# Altium schematic sheet Dout32x.SchDoc: Dout32x
size A3; Author: Daniel Tzschentke; Revision: A
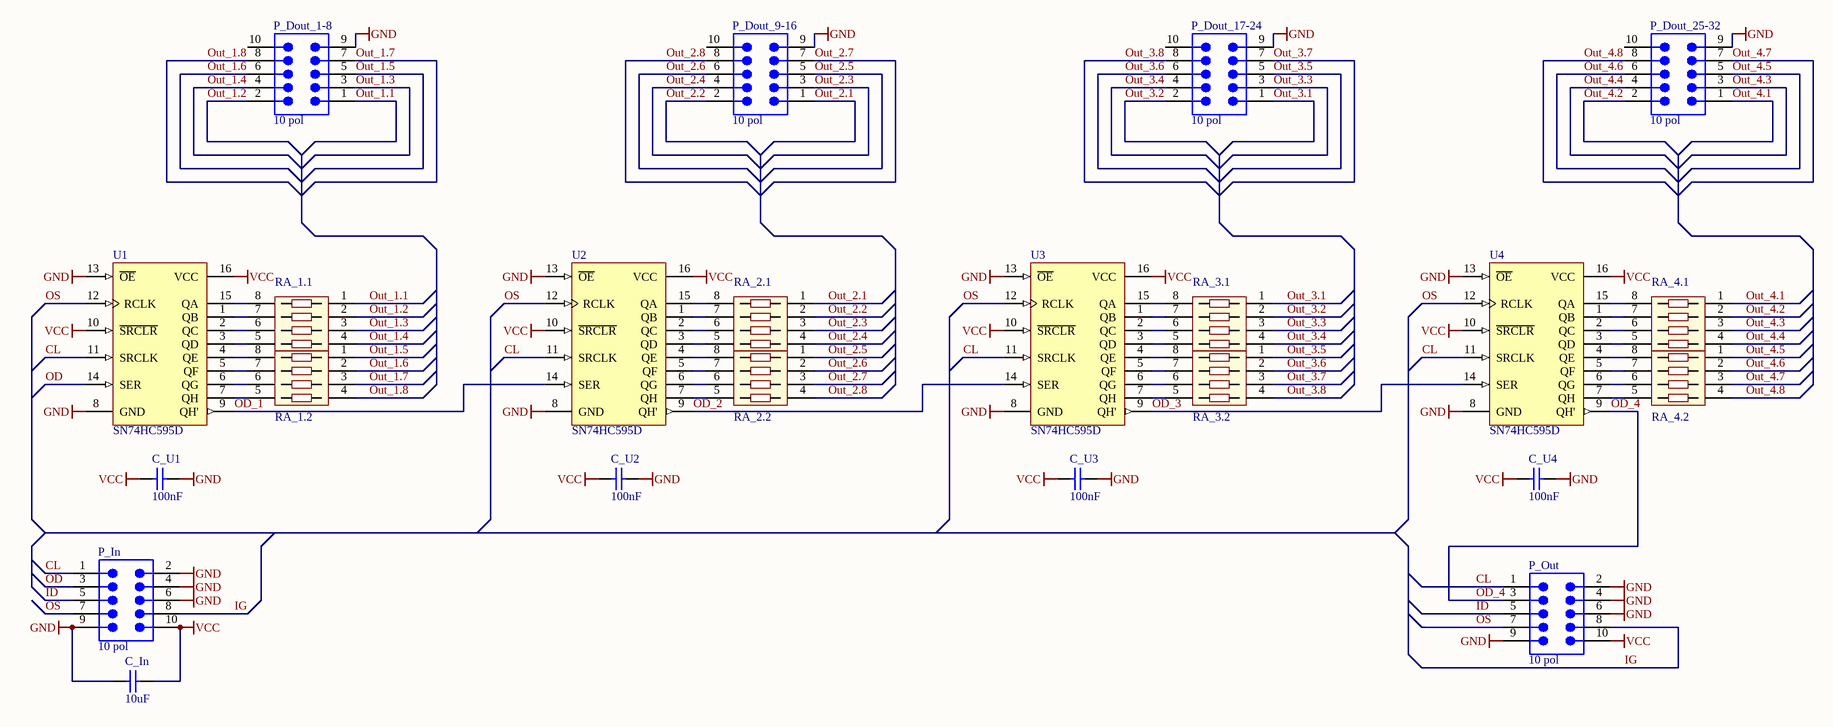
[diagram p0: Dout32x.SchDoc]

## Parts
C_In  value 10uF  [1608[0603]]  (hidden comment: Cap Semi)
C_U1  value 100nF  [1608[0603]]  (hidden comment: Cap Semi)
C_U2  value 100nF  [1608[0603]]  (hidden comment: Cap Semi)
C_U3  value 100nF  [1608[0603]]  (hidden comment: Cap Semi)
C_U4  value 100nF  [1608[0603]]  (hidden comment: Cap Semi)
P_Dout_1-8  10 pol  [918510x324]
P_Dout_9-16  10 pol  [918510x324]
P_Dout_17-24  10 pol  [918510x324]
P_Dout_25-32  10 pol  [918510x324]
P_In  10 pol  [918510x324]
P_Out  10 pol  [918510x324]
RA_1.1  EXB38  [EXB38]  (value not drawn)
RA_1.2  EXB38  [EXB38]  (value not drawn)
RA_2.1  EXB38  [EXB38]  (value not drawn)
RA_2.2  EXB38  [EXB38]  (value not drawn)
RA_3.1  EXB38  [EXB38]  (value not drawn)
RA_3.2  EXB38  [EXB38]  (value not drawn)
RA_4.1  EXB38  [EXB38]  (value not drawn)
RA_4.2  EXB38  [EXB38]  (value not drawn)
U1  SN74HC595D  [D016_N]
U2  SN74HC595D  [D016_N]
U3  SN74HC595D  [D016_N]
U4  SN74HC595D  [D016_N]

## Nets
GND: C_In.1 C_U1.1 C_U2.1 C_U3.1 C_U4.1 P_Dout_1-8.9 P_Dout_9-16.9 P_Dout_17-24.9 P_Dout_25-32.9 P_In.2 P_In.4 P_In.6 P_In.9 P_Out.2 P_Out.4 P_Out.6 P_Out.9 U1.8(GND) U1.13(~{OE}) U2.8(GND) U2.13(~{OE}) U3.8(GND) U3.13(~{OE}) U4.8(GND) U4.13(~{OE})
VCC: C_In.2 C_U1.2 C_U2.2 C_U3.2 C_U4.2 P_In.10 P_Out.10 U1.10(~{SRCLR}) U1.16(VCC) U2.10(~{SRCLR}) U2.16(VCC) U3.10(~{SRCLR}) U3.16(VCC) U4.10(~{SRCLR}) U4.16(VCC)
CL: P_In.1 P_Out.1 U1.11(SRCLK) U2.11(SRCLK) U3.11(SRCLK) U4.11(SRCLK)
ID: P_In.5 P_Out.5
IG: P_In.8 P_Out.8
OD: P_In.3 U1.14(SER)
OD_1: U1.9(QH') U2.14(SER)
OD_2: U2.9(QH') U3.14(SER)
OD_3: U3.9(QH') U4.14(SER)
OD_4: P_Out.3 U4.9(QH')
OS: P_In.7 P_Out.7 U1.12(RCLK) U2.12(RCLK) U3.12(RCLK) U4.12(RCLK)
Out_1.1: P_Dout_1-8.1 RA_1.1.1
Out_1.2: P_Dout_1-8.2 RA_1.1.2
Out_1.3: P_Dout_1-8.3 RA_1.1.3
Out_1.4: P_Dout_1-8.4 RA_1.1.4
Out_1.5: P_Dout_1-8.5 RA_1.2.1
Out_1.6: P_Dout_1-8.6 RA_1.2.2
Out_1.7: P_Dout_1-8.7 RA_1.2.3
Out_1.8: P_Dout_1-8.8 RA_1.2.4
Out_2.1: P_Dout_9-16.1 RA_2.1.1
Out_2.2: P_Dout_9-16.2 RA_2.1.2
Out_2.3: P_Dout_9-16.3 RA_2.1.3
Out_2.4: P_Dout_9-16.4 RA_2.1.4
Out_2.5: P_Dout_9-16.5 RA_2.2.1
Out_2.6: P_Dout_9-16.6 RA_2.2.2
Out_2.7: P_Dout_9-16.7 RA_2.2.3
Out_2.8: P_Dout_9-16.8 RA_2.2.4
Out_3.1: P_Dout_17-24.1 RA_3.1.1
Out_3.2: P_Dout_17-24.2 RA_3.1.2
Out_3.3: P_Dout_17-24.3 RA_3.1.3
Out_3.4: P_Dout_17-24.4 RA_3.1.4
Out_3.5: P_Dout_17-24.5 RA_3.2.1
Out_3.6: P_Dout_17-24.6 RA_3.2.2
Out_3.7: P_Dout_17-24.7 RA_3.2.3
Out_3.8: P_Dout_17-24.8 RA_3.2.4
Out_4.1: P_Dout_25-32.1 RA_4.1.1
Out_4.2: P_Dout_25-32.2 RA_4.1.2
Out_4.3: P_Dout_25-32.3 RA_4.1.3
Out_4.4: P_Dout_25-32.4 RA_4.1.4
Out_4.5: P_Dout_25-32.5 RA_4.2.1
Out_4.6: P_Dout_25-32.6 RA_4.2.2
Out_4.7: P_Dout_25-32.7 RA_4.2.3
Out_4.8: P_Dout_25-32.8 RA_4.2.4
NetRA_1.1_5: RA_1.1.5 U1.3(QD)
NetRA_1.1_6: RA_1.1.6 U1.2(QC)
NetRA_1.1_7: RA_1.1.7 U1.1(QB)
NetRA_1.1_8: RA_1.1.8 U1.15(QA)
NetRA_1.2_5: RA_1.2.5 U1.7(QH)
NetRA_1.2_6: RA_1.2.6 U1.6(QG)
NetRA_1.2_7: RA_1.2.7 U1.5(QF)
NetRA_1.2_8: RA_1.2.8 U1.4(QE)
NetRA_2.1_5: RA_2.1.5 U2.3(QD)
NetRA_2.1_6: RA_2.1.6 U2.2(QC)
NetRA_2.1_7: RA_2.1.7 U2.1(QB)
NetRA_2.1_8: RA_2.1.8 U2.15(QA)
NetRA_2.2_5: RA_2.2.5 U2.7(QH)
NetRA_2.2_6: RA_2.2.6 U2.6(QG)
NetRA_2.2_7: RA_2.2.7 U2.5(QF)
NetRA_2.2_8: RA_2.2.8 U2.4(QE)
NetRA_3.1_5: RA_3.1.5 U3.3(QD)
NetRA_3.1_6: RA_3.1.6 U3.2(QC)
NetRA_3.1_7: RA_3.1.7 U3.1(QB)
NetRA_3.1_8: RA_3.1.8 U3.15(QA)
NetRA_3.2_5: RA_3.2.5 U3.7(QH)
NetRA_3.2_6: RA_3.2.6 U3.6(QG)
NetRA_3.2_7: RA_3.2.7 U3.5(QF)
NetRA_3.2_8: RA_3.2.8 U3.4(QE)
NetRA_4.1_5: RA_4.1.5 U4.3(QD)
NetRA_4.1_6: RA_4.1.6 U4.2(QC)
NetRA_4.1_7: RA_4.1.7 U4.1(QB)
NetRA_4.1_8: RA_4.1.8 U4.15(QA)
NetRA_4.2_5: RA_4.2.5 U4.7(QH)
NetRA_4.2_6: RA_4.2.6 U4.6(QG)
NetRA_4.2_7: RA_4.2.7 U4.5(QF)
NetRA_4.2_8: RA_4.2.8 U4.4(QE)

Not connected (* = marked no-connect by the designer): P_Dout_1-8 10; P_Dout_9-16 10; P_Dout_17-24 10; P_Dout_25-32 10

## Library data of the parts
C_In C_U1-C_U4 = Cap Semi: Capacitor (Semiconductor SIM Model); Published: 8-Jun-2000; LatestRevisionDate: 29-May-2009; LatestRevisionNote: IPC-7351 Footprint Added.; PackageReference: C1206; Publisher: Altium Limited; PackageDescription: Chip Capacitor
P_Dout_1-8 P_Dout_9-16 P_Dout_17-24 P_Dout_25-32 P_In P_Out = 09 18 510 6324: Flat Cable Connector (IDC), Low-Profile Male Header, Straight Solder Pin, 10 Contacts, Performance Level 2; PCB_Layout: Complies with manufacturer's recommendation.; DrillSize: Corresponds to nominal value.; Published: 15-Nov-2004; DatasheetDocument: Sep-2003; PackageDocument: 03-Jun-2003; PackageReference: 918510x324; Publisher: Altium Limited; ComponentLink1Description: Manufacturer Link; ComponentLink1URL: http://www.harting.com/; ComponentLink2Description: Selection Guide; ComponentLink2URL: http://www.harting.com/imperia/md/content/steckverbinderundsystemkomponenten/folder/interface_engl_chapter_09.pdf
RA_1.1 RA_1.2 RA_2.1 RA_2.2 RA_3.1 RA_3.2 RA_4.1 RA_4.2 = 4 Resistors Parallel: Published: 8-Jun-2000; LatestRevisionDate: 29-May-2009; LatestRevisionNote: IPC-7351 Footprint Added.; PackageReference: C1206; Publisher: Altium Limited; PackageDescription: Chip Capacitor
U1-U4 = SN74HC595D: 8-Bit Shift Register with 3-State Output Registers; Published: 8-Jun-2000; LatestRevisionDate: 13-Apr-2006; LatestRevisionNote: IPC-7351 Footprint Added.; DatasheetVersion: May-1997; PackageVersion: Jan-1998; PackageReference: D016; Publisher: Altium Limited; PackageDescription: 16-Pin Small Outline Integrated Circuit 1.27 mm Pitch; Code_IPC: SOIC127P600-16; ComponentLink1Description: Manufacturer Link; ComponentLink1URL: http://www.ti.com/; ComponentLink2Description: Datasheet; ComponentLink2URL: http://www-s.ti.com/sc/ds/sn74hc595.pdf